# EAGLE schematic shield_scaffold (EAGLE 5.07)
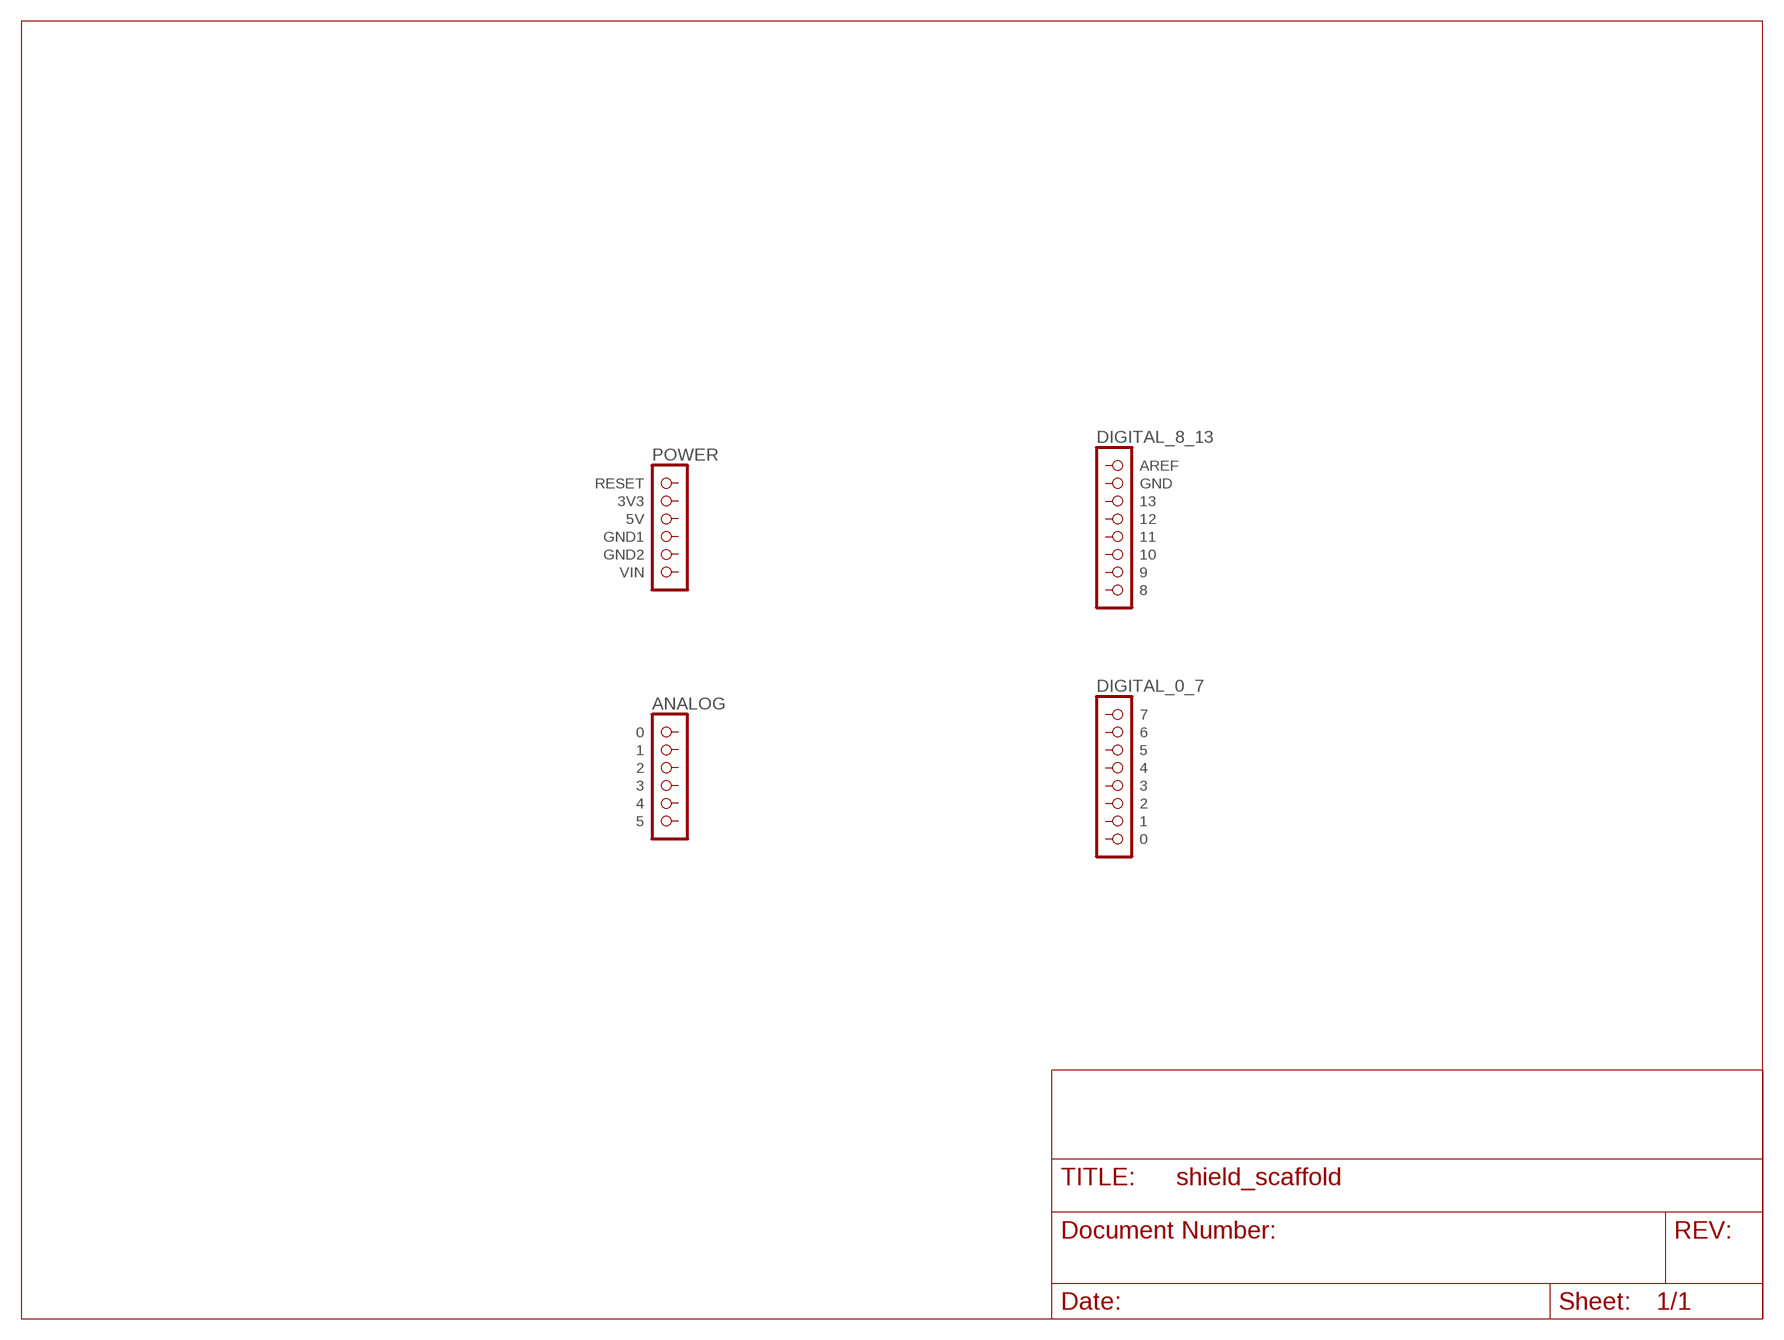
[diagram p0: schematic, sheet 1]

## Parts
U$1  POWER  [1X06]
U$2  ANALOG  [1X06]
U$3  DIGITAL_0_7  [1X08]
U$4  DIGITAL_8_13  [1X08]
Unconnected: U$1.1(RESET) U$1.2(3V3) U$1.3(5V) U$1.4(GND1) U$1.5(GND2) U$1.6(VIN) U$2.1 U$2.2 U$2.3 U$2.4 U$2.5 U$2.6 U$3.1 U$3.2 U$3.3 U$3.4 U$3.5 U$3.6 U$3.7 U$3.8 U$4.1(AREF) U$4.2(GND) U$4.3 U$4.4 U$4.5 U$4.6 U$4.7 U$4.8

## Library data of the parts
U$1 = arduino:POWER
U$2 = arduino:ANALOG
U$3 = arduino:DIGITAL_0_7
U$4 = arduino:DIGITAL_8_13